# Altium project programmer.PrjPCB
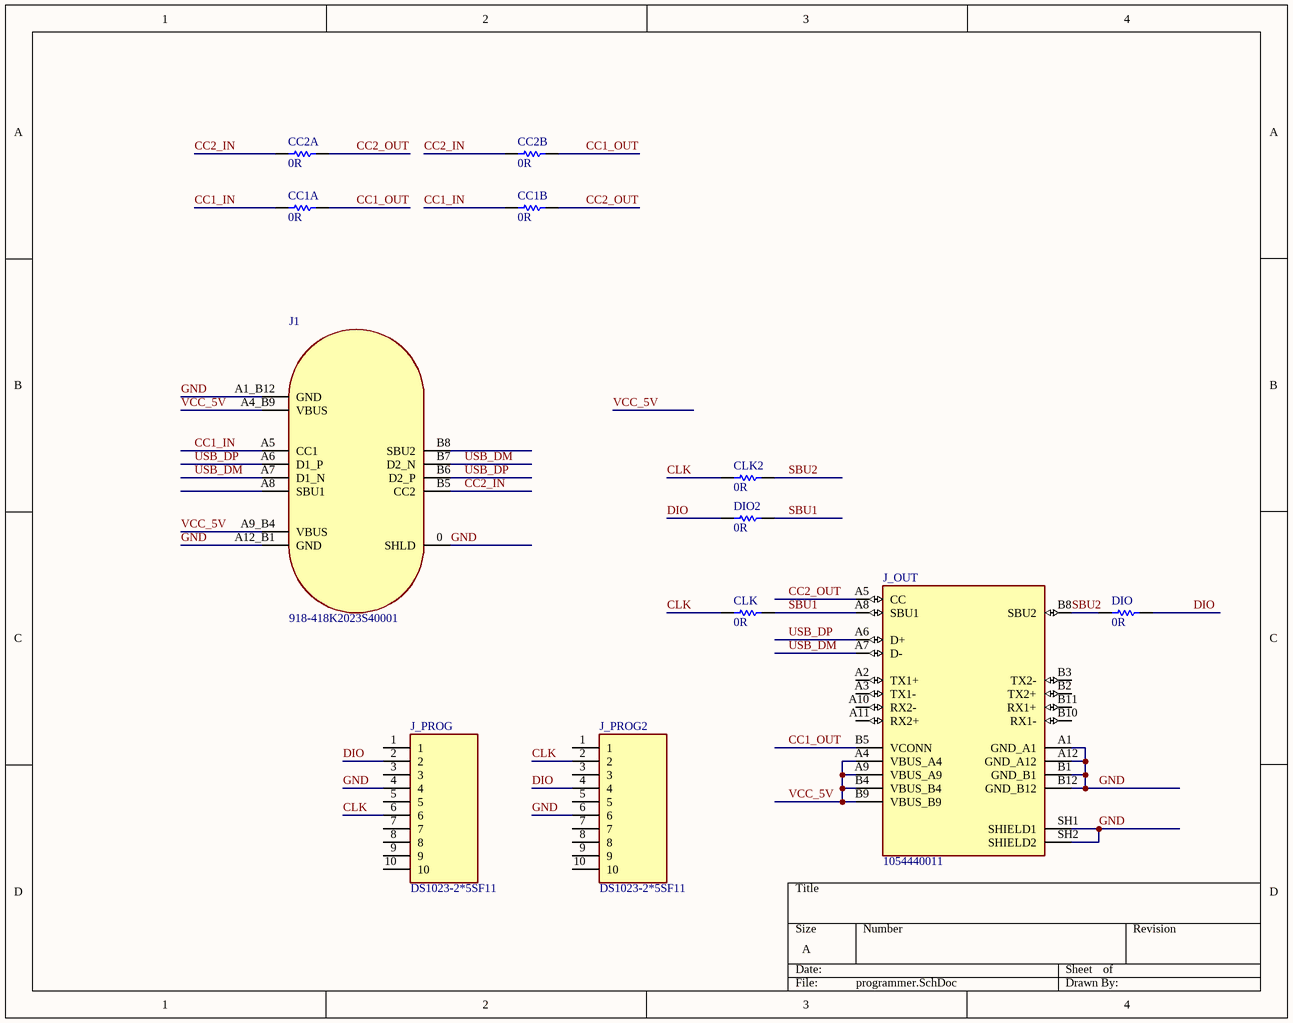
[diagram p0: programmer.SchDoc]
1 sheet, 12 parts. Net scope: global (net labels, ports and power ports of the same name join across sheets).
Board file: programmer.PcbDoc

## Sheet programmer.SchDoc
size A

### Parts
CC1A  value 0R  [R_0402]  (hidden comment: 0402WGF0000TCE)
CC1B  value 0R  [R_0402]  (hidden comment: 0402WGF0000TCE)
CC2A  value 0R  [R_0402]  (hidden comment: 0402WGF0000TCE)
CC2B  value 0R  [R_0402]  (hidden comment: 0402WGF0000TCE)
CLK  value 0R  [R_0402]  (hidden comment: 0402WGF0000TCE)
CLK2  value 0R  [R_0402]  (hidden comment: 0402WGF0000TCE)
DIO  value 0R  [R_0402]  (hidden comment: 0402WGF0000TCE)
DIO2  value 0R  [R_0402]  (hidden comment: 0402WGF0000TCE)
J1  918-418K2023S40001  [918-418K2023S40001]
J_OUT  1054440011  [MOLEX_1054440011]
J_PROG  DS1023-2*5SF11  [HDR_FEM_2X5P]
J_PROG2  DS1023-2*5SF11  [HDR_FEM_2X5P]

### Nets
CC1_IN: CC1A.1 CC1B.1 J1.A5(CC1)
CC1_OUT: CC1A.2 CC2B.2 J_OUT.B5(VCONN)
CC2_IN: CC2A.1 CC2B.1 J1.B5(CC2)
CC2_OUT: CC1B.2 CC2A.2 J_OUT.A5(CC)
CLK: CLK.1 CLK2.1 J_PROG.6 J_PROG2.2
DIO: DIO.2 DIO2.1 J_PROG.2 J_PROG2.4
GND: J1.0(SHLD) J1.A1_B12(GND) J1.A12_B1(GND) J_OUT.A1(GND_A1) J_OUT.A12(GND_A12) J_OUT.B1(GND_B1) J_OUT.B12(GND_B12) J_OUT.SH1(SHIELD1) J_OUT.SH2(SHIELD2) J_PROG.4 J_PROG2.6
SBU1: CLK.2 DIO2.2 J_OUT.A8(SBU1)
SBU2: CLK2.2 DIO.1 J_OUT.B8(SBU2)
USB_DM: J1.A7(D1_N) J1.B7(D2_N) J_OUT.A7(D-)
USB_DP: J1.A6(D1_P) J1.B6(D2_P) J_OUT.A6(D+)
VCC_5V: J1.A4_B9(VBUS) J1.A9_B4(VBUS) J_OUT.A4(VBUS_A4) J_OUT.A9(VBUS_A9) J_OUT.B4(VBUS_B4) J_OUT.B9(VBUS_B9)

Not connected (* = marked no-connect by the designer): J1 A8(SBU1) B8(SBU2); J_OUT A2(TX1+) A3(TX1-) A10(RX2-) A11(RX2+) B2(TX2+) B3(TX2-) B10(RX1-) B11(RX1+); J_PROG 1 3 5 7 8 9 10; J_PROG2 1 3 5 7 8 9 10

### Library data of the parts
CC1A CC1B CC2A CC2B CLK CLK2 DIO DIO2 = 0402WGF0000TCE: R - RESISTOR - SMD - 0R - 1% - 0402; LCSC Part #: C17168; JLC Availability: Basic
J1 = 918-418K2023S40001: J - JACK - USB - Type C - Recepticle - SMT - 90°; JLC Availability: LCSC; LCSC Part #: C167321
J_OUT = 1054440011: J - JACK - Universal Serial Bus (USB) Shielded I/O Plug, Type C, Right-Angle, Surface Mount, 0.76m Gold (Au) Plating, Tape and Reel; MF: Molex; JLC Availability: Extended; LCSC PART #: C561769; Value: *; MP: 1054440011; Check_prices: https://www.snapeda.com/parts/1054440011/Molex/view-part/?ref=eda
J_PROG J_PROG2 = DS1023-2*5SF11: J - JACK - PIN_HEADER 2X5P; LCSC Part #: C92270; JLC Availability: Extended

## Assembly variants
CONFIG1: not fitted CC2A CC2B CLK2 DIO2